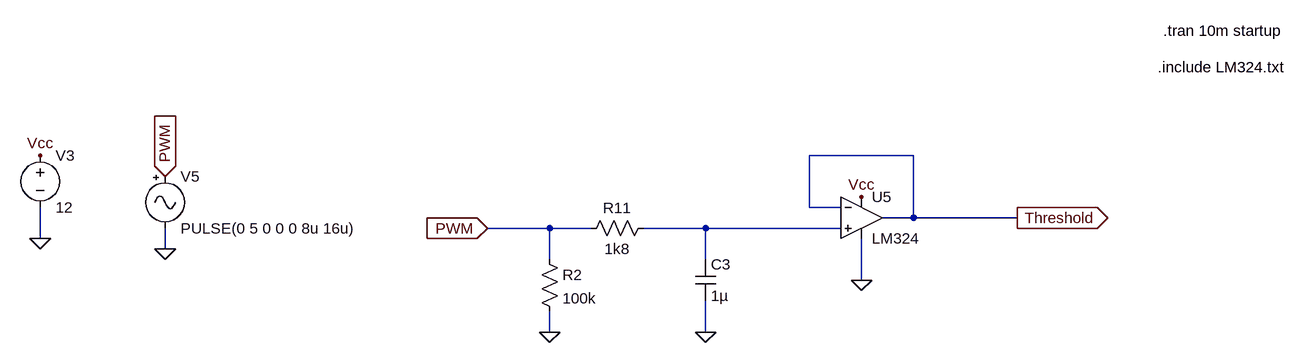
[diagram p0: schematic pwm-threshold.asc]
pwm-threshold.asc, the LTspice schematic file:
Version 4
SHEET 1 1304 1124
WIRE 80 144 -80 144
WIRE -80 224 -80 144
WIRE -32 224 -80 224
WIRE 80 240 80 144
WIRE 80 240 32 240
WIRE 240 240 80 240
WIRE -480 256 -576 256
WIRE -416 256 -480 256
WIRE -240 256 -336 256
WIRE -32 256 -240 256
WIRE -1264 272 -1264 224
WIRE -1072 288 -1072 256
WIRE -480 304 -480 256
WIRE -240 304 -240 256
WIRE 0 336 0 272
WIRE -480 416 -480 384
WIRE -240 416 -240 368
FLAG -1264 144 Vcc
FLAG -1264 272 0
FLAG -576 256 PWM
IOPIN -576 256 In
FLAG 0 208 Vcc
FLAG 0 336 0
FLAG 240 240 Threshold
IOPIN 240 240 Out
FLAG -240 416 0
FLAG -1072 288 0
FLAG -1072 176 PWM
IOPIN -1072 176 In
FLAG -480 416 0
SYMBOL voltage -1264 128 R0
WINDOW 123 0 0 Left 2
WINDOW 39 0 0 Left 2
SYMATTR InstName V3
SYMATTR Value 12
SYMBOL res -320 240 R90
WINDOW 0 0 56 VBottom 2
WINDOW 3 32 56 VTop 2
SYMATTR InstName R11
SYMATTR Value 1k8
SYMBOL cap -256 304 R0
SYMATTR InstName C3
SYMATTR Value 1µ
SYMBOL Opamps\\opamp2 0 176 R0
SYMATTR InstName U5
SYMATTR Value LM324
SYMBOL Misc\\signal -1072 160 R0
WINDOW 123 0 0 Left 2
WINDOW 39 0 0 Left 2
SYMATTR InstName V5
SYMATTR Value PULSE(0 5 0 0 0 8u 16u)
SYMBOL res -496 288 R0
SYMATTR InstName R2
SYMATTR Value 100k
TEXT 456 8 Left 2 !.include LM324.txt
TEXT 464 -48 Left 2 !.tran 10m startup

The netlist it stands for:
* pwm-threshold.asc
V3 Vcc 0 12
R11 N001 PWM 1k8
C3 N001 0 1µ
XU5 N001 Threshold Vcc 0 Threshold LM324  ; pins In+ In- V+ V- OUT
V5 PWM 0 PULSE(0 5 0 0 0 8u 16u)
R2 PWM 0 100k
.include LM324.txt
.tran 10m startup
.backanno
.end